# EAGLE schematic multi-chip (EAGLE 8.2.1)
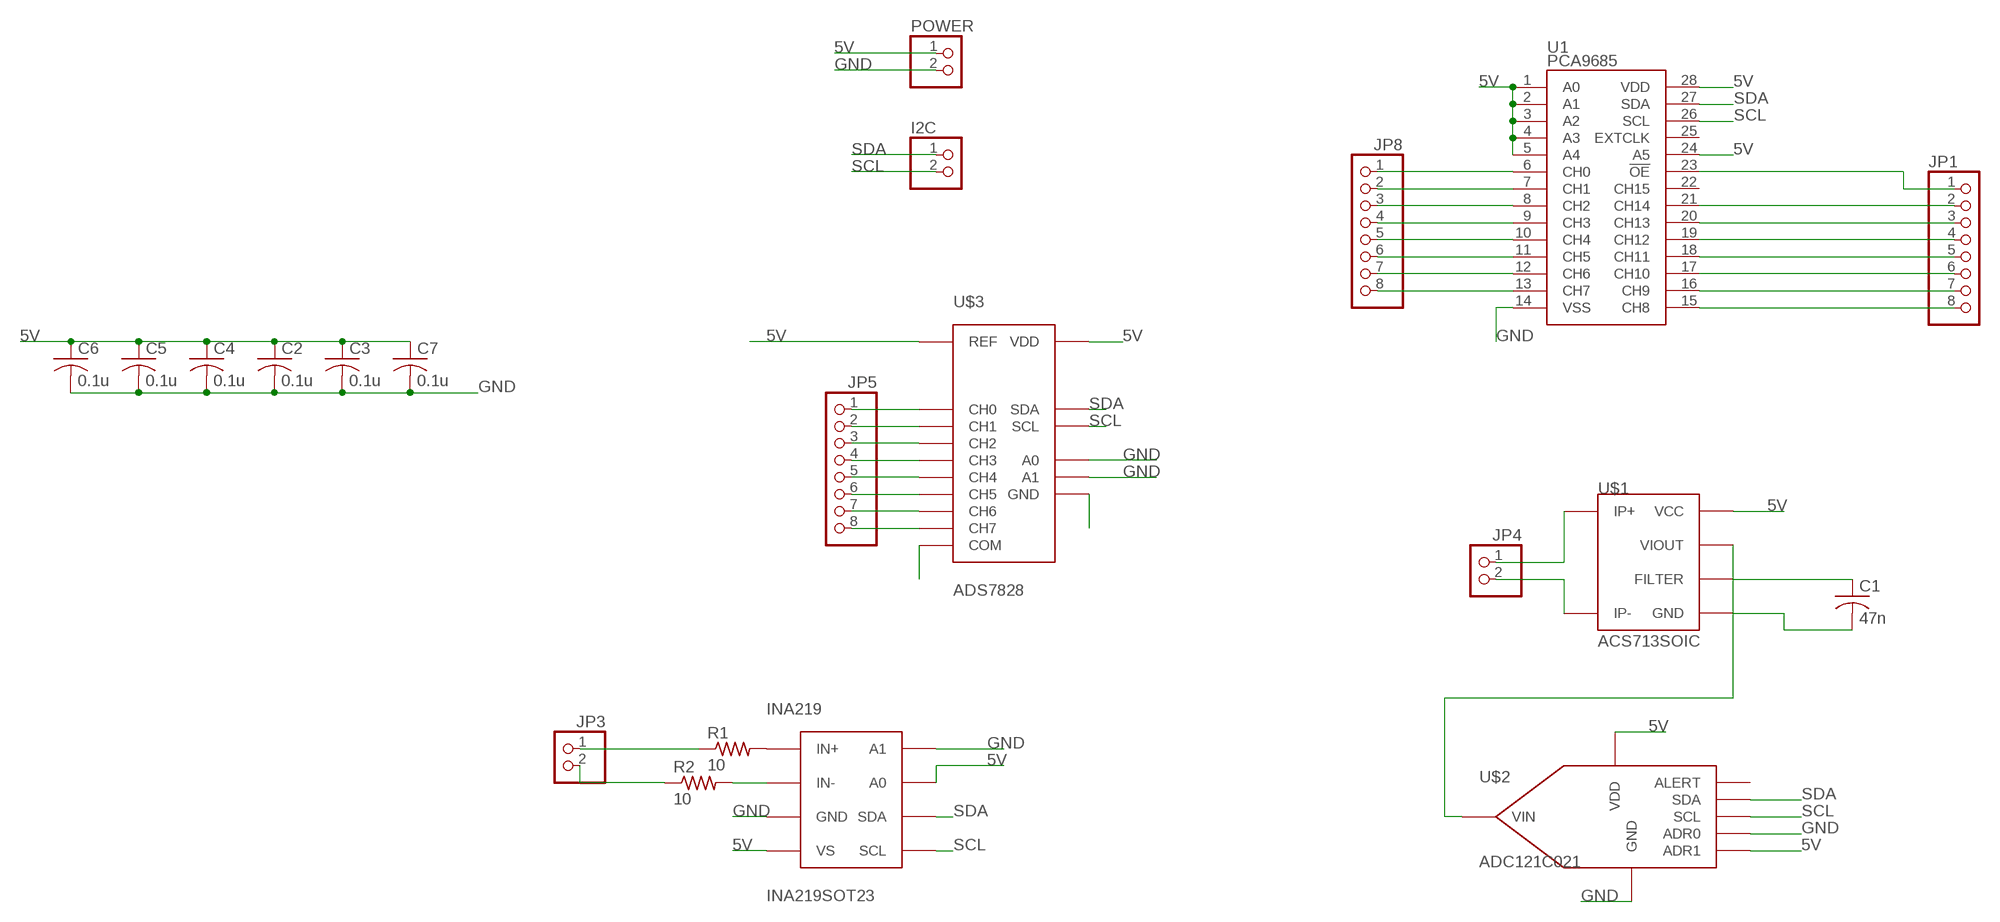
[diagram p0: schematic, sheet 1]

## Parts
C1  47n  C-USC0805  [C0805]
C2  0.1u  C-USC0805  [C0805]
C3  0.1u  C-USC0805  [C0805]
C4  0.1u  C-USC0805  [C0805]
C5  0.1u  C-USC0805  [C0805]
C6  0.1u  C-USC0805  [C0805]
C7  0.1u  C-USC0805  [C0805]
I2C  PINHD-1X2  [1X02]
INA219  INA219SOT23  [SOT-23-8]
JP1  PINHD-1X8  [1X08]
JP3  PINHD-1X2  [1X02]
JP4  PINHD-1X2  [1X02]
JP5  PINHD-1X8  [1X08]
JP8  PINHD-1X8  [1X08]
POWER  PINHD-1X2  [1X02]
R1  10  R-US_R0805  [R0805]
R2  10  R-US_R0805  [R0805]
U1  PCA9685  [TSSOP-28_4MM]
U$1  ACS713SOIC  [ACS713-SOIC]
U$2  ADC121C021  [VSSOP-8]
U$3  ADS7828  [TSSOP16]

## Nets
5V: C2.1 C3.1 C4.1 C5.1 C6.1 C7.1 INA219.P$4(VS) INA219.P$7(A0) POWER.1 U1.1(A0) U1.2(A1) U1.3(A2) U1.4(A3) U1.5(A4) U1.24(A5) U1.28(VDD) U$1.P$8(VCC) U$2.P$5(VDD) U$2.P$6(ADR1) U$3.10(REF) U$3.16(VDD)
GND: C1.2 C2.2 C3.2 C4.2 C5.2 C6.2 C7.2 INA219.P$3(GND) INA219.P$8(A1) POWER.2 U1.14(VSS) U$1.P$5(GND) U$2.P$3(ADR0) U$2.P$7(GND) U$3.9(GND) U$3.11(COM) U$3.12(A0) U$3.13(A1)
IN+: JP3.1 R1.1
IN-: JP3.2 R2.1
N$1: C1.1 U$1.P$6(FILTER)
N$2: INA219.P$1(IN+) R1.2
N$3: INA219.P$2(IN-) R2.2
N$4: JP1.8 U1.15(CH8)
N$5: JP4.1 U$1.P$1(IP+) U$1.P$2(IP+)
N$8: JP4.2 U$1.P$3(IP-) U$1.P$4(IP-)
N$9: U$1.P$7(VIOUT) U$2.P$4(VIN)
N$15: JP5.1 U$3.1(CH0)
N$16: JP5.2 U$3.2(CH1)
N$17: JP5.3 U$3.3(CH2)
N$18: JP5.4 U$3.4(CH3)
N$19: JP5.5 U$3.5(CH4)
N$20: JP5.6 U$3.6(CH5)
N$21: JP5.7 U$3.7(CH6)
N$22: JP5.8 U$3.8(CH7)
N$44: JP8.1 U1.6(CH0)
N$45: JP8.2 U1.7(CH1)
N$46: JP8.3 U1.8(CH2)
N$47: JP8.4 U1.9(CH3)
N$48: JP8.5 U1.10(CH4)
N$49: JP8.6 U1.11(CH5)
N$50: JP8.7 U1.12(CH6)
N$51: JP8.8 U1.13(CH7)
N$58: JP1.1 U1.23(!OE)
N$60: JP1.2 U1.21(CH14)
N$61: JP1.3 U1.20(CH13)
N$62: JP1.4 U1.19(CH12)
N$63: JP1.5 U1.18(CH11)
N$64: JP1.6 U1.17(CH10)
N$65: JP1.7 U1.16(CH9)
SCL: I2C.2 INA219.P$5(SCL) U1.26(SCL) U$2.P$1(SCL) U$3.14(SCL)
SDA: I2C.1 INA219.P$6(SDA) U1.27(SDA) U$2.P$8(SDA) U$3.15(SDA)
Unconnected: U1.22(CH15) U1.25(EXTCLK) U$2.P$2(ALERT)

## Library data of the parts
C1-C7 = resistor:C-US: CAPACITOR, American symbol
I2C JP3 JP4 POWER = pinhead:PINHD-1X2: PIN HEADER
INA219 = texas:INA219: TI INA219 Voltage/Current/Power monitor with I2C Datasheet <http://www.ti.com/lit/ds/symlink/ina219.pdf>
JP1 JP5 JP8 = pinhead:PINHD-1X8: PIN HEADER
R1 R2 = resistor:R-US_: RESISTOR, American symbol
U1 = NXP:PCA9685: 16-channel 12-bit PWM I2C interface Internal Oscillator 40Hz to 1kHz Can be totem pole or open collector 2.3V to 5.5V; PROD_ID: IC-12240
U$1 = allegro:ACS713
U$2 = texas:ADC121C021: ADC121C021 8-pin VSSOP package 1 channel, 12-bit I2C ADC Datasheet <http://www.ti.com/lit/ds/symlink/adc121c021.pdf>
U$3 = texas:ADS7828: Texas Instruments ADS7828 8-channel 12-bit I2C ADC Datasheet <http://www.ti.com/lit/ds/symlink/ads7828.pdf>